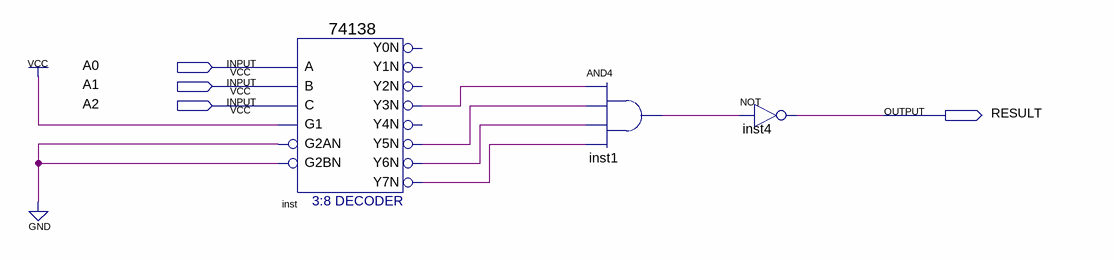
[diagram p0: schematic sheet]
// Quartus schematic E3_74138.bdf as structural Verilog: 3 symbols, 4 pins
module E3_74138 (
  input  A0,
  input  A1,
  input  A2,
  output RESULT
);

  wire inst1_out, inst_y3n, inst_y5n, inst_y6n, inst_y7n;

  \74138  inst (
    .A(A0), .B(A1), .G1(1'b1), .C(A2), .G2AN(1'b0), .G2BN(1'b0), .Y3N(inst_y3n), .Y5N(inst_y5n),
    .Y6N(inst_y6n), .Y7N(inst_y7n));  // open: Y0N, Y1N, Y2N, Y4N
  and inst1 (inst1_out, inst_y3n, inst_y5n, inst_y6n, inst_y7n);
  not inst4 (RESULT, inst1_out);
endmodule
